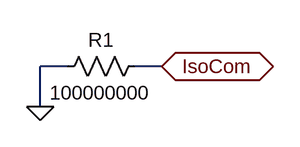
[diagram p0: schematic IsoCom.asc]
IsoCom.asc, the LTspice schematic file:
Version 4
SHEET 1 880 680
WIRE 160 144 128 144
WIRE 272 144 240 144
WIRE 128 192 128 144
FLAG 128 192 0
FLAG 272 144 IsoCom
IOPIN 272 144 BiDir
SYMBOL res 256 128 R90
WINDOW 0 0 56 VBottom 0
WINDOW 3 32 56 VTop 0
SYMATTR InstName R1
SYMATTR Value 100000000

The netlist it stands for:
* IsoCom.asc
R1 IsoCom 0 100000000
.backanno
.end